# EAGLE design bbb-unibus (EAGLE 6.6.0)
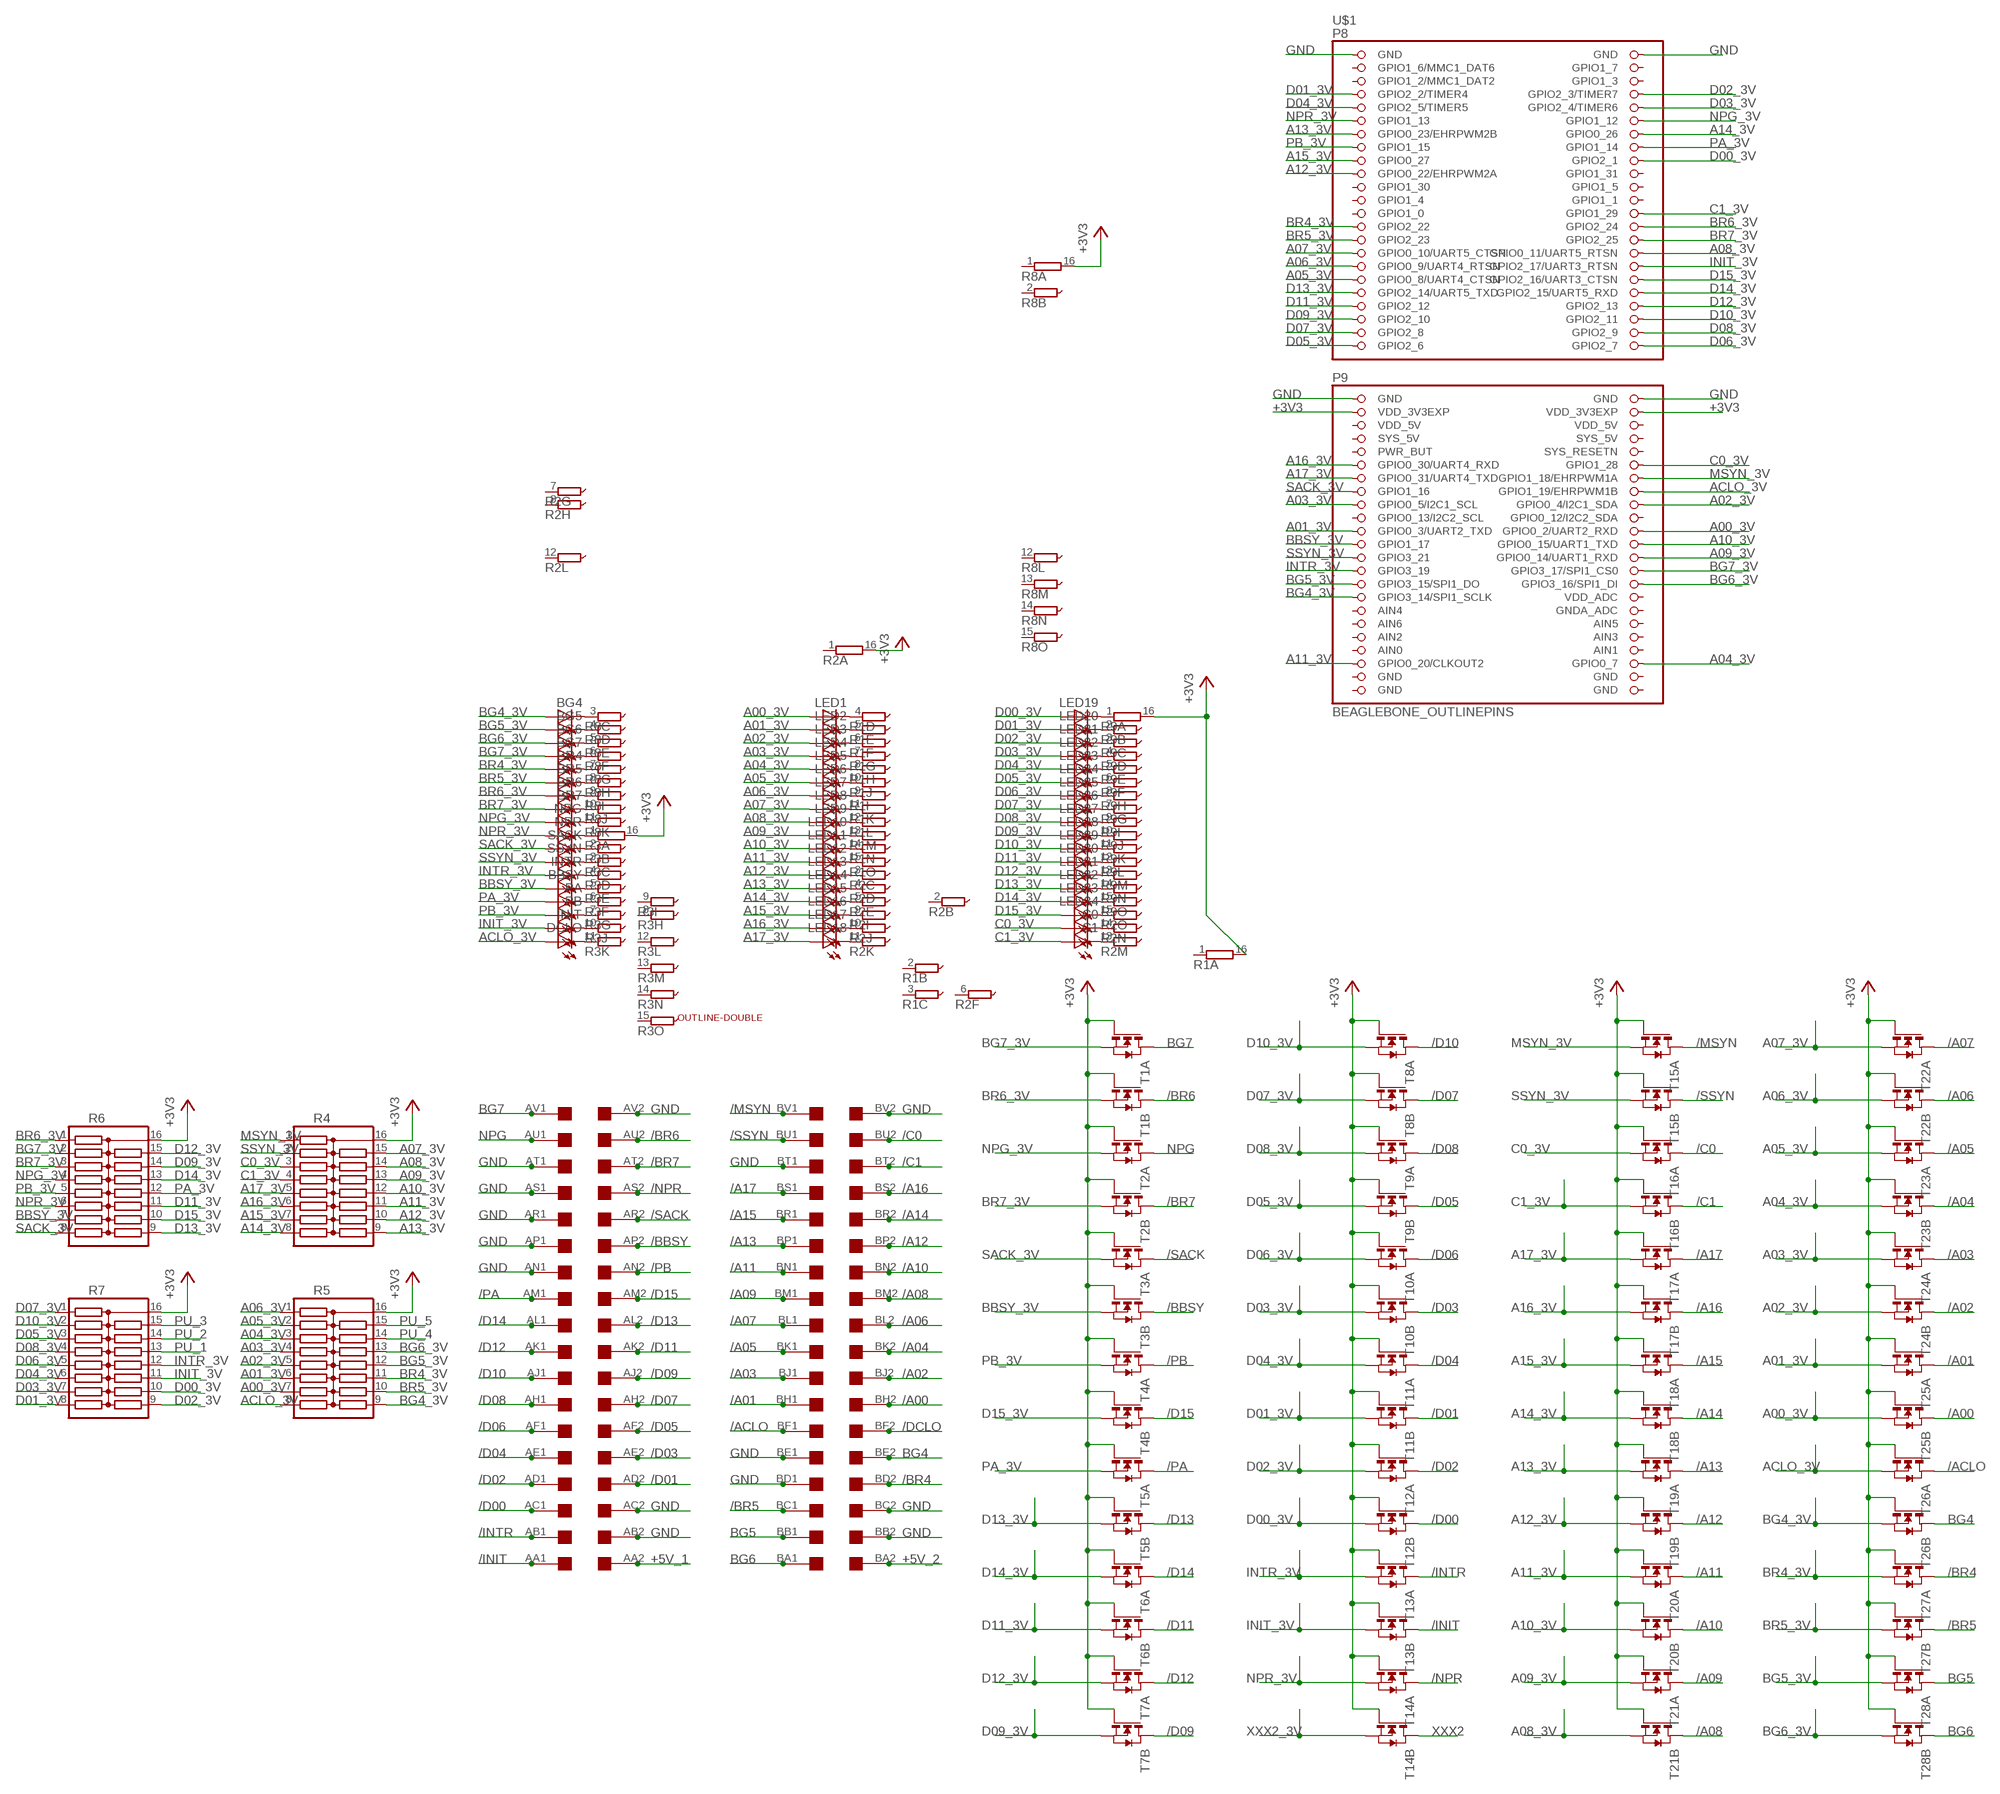
[diagram p0: schematic, sheet 1]

## Parts
BBSY  LEDSML0805  [SML0805]
BG4  LEDSML0805  [SML0805]
BG5  LEDSML0805  [SML0805]
BG6  LEDSML0805  [SML0805]
BG7  LEDSML0805  [SML0805]
BR4  LEDSML0805  [SML0805]
BR5  LEDSML0805  [SML0805]
BR6  LEDSML0805  [SML0805]
BR7  LEDSML0805  [SML0805]
C0  LEDSML0805  [SML0805]
C1  LEDSML0805  [SML0805]
DCLO  LEDSML0805  [SML0805]
INIT  LEDSML0805  [SML0805]
INTR  LEDSML0805  [SML0805]
LED1  LEDSML0805  [SML0805]
LED2  LEDSML0805  [SML0805]
LED3  LEDSML0805  [SML0805]
LED4  LEDSML0805  [SML0805]
LED5  LEDSML0805  [SML0805]
LED6  LEDSML0805  [SML0805]
LED7  LEDSML0805  [SML0805]
LED8  LEDSML0805  [SML0805]
LED9  LEDSML0805  [SML0805]
LED10  LEDSML0805  [SML0805]
LED11  LEDSML0805  [SML0805]
LED12  LEDSML0805  [SML0805]
LED13  LEDSML0805  [SML0805]
LED14  LEDSML0805  [SML0805]
LED15  LEDSML0805  [SML0805]
LED16  LEDSML0805  [SML0805]
LED17  LEDSML0805  [SML0805]
LED18  LEDSML0805  [SML0805]
LED19  LEDSML0805  [SML0805]
LED20  LEDSML0805  [SML0805]
LED21  LEDSML0805  [SML0805]
LED22  LEDSML0805  [SML0805]
LED23  LEDSML0805  [SML0805]
LED24  LEDSML0805  [SML0805]
LED25  LEDSML0805  [SML0805]
LED26  LEDSML0805  [SML0805]
LED27  LEDSML0805  [SML0805]
LED28  LEDSML0805  [SML0805]
LED29  LEDSML0805  [SML0805]
LED30  LEDSML0805  [SML0805]
LED31  LEDSML0805  [SML0805]
LED32  LEDSML0805  [SML0805]
LED33  LEDSML0805  [SML0805]
LED34  LEDSML0805  [SML0805]
NPG  LEDSML0805  [SML0805]
NPR  LEDSML0805  [SML0805]
PA  LEDSML0805  [SML0805]
PB  LEDSML0805  [SML0805]
R1  2QSP16-15E  [2QSP16]
R2  2QSP16-15E  [2QSP16]
R3  2QSP16-15E  [2QSP16]
R4  2QSP16-15  [2QSP16]
R5  2QSP16-15  [2QSP16]
R6  2QSP16-15  [2QSP16]
R7  2QSP16-15  [2QSP16]
R8  2QSP16-15E  [2QSP16]
R9  2QSP16-15E  [2QSP16]
SACK  LEDSML0805  [SML0805]
SSYN  LEDSML0805  [SML0805]
T1  NMOS2-BSS138DW  [SOT363]
T2  NMOS2-BSS138DW  [SOT363]
T3  NMOS2-BSS138DW  [SOT363]
T4  NMOS2-BSS138DW  [SOT363]
T5  NMOS2-BSS138DW  [SOT363]
T6  NMOS2-BSS138DW  [SOT363]
T7  NMOS2-BSS138DW  [SOT363]
T8  NMOS2-BSS138DW  [SOT363]
T9  NMOS2-BSS138DW  [SOT363]
T10  NMOS2-BSS138DW  [SOT363]
T11  NMOS2-BSS138DW  [SOT363]
T12  NMOS2-BSS138DW  [SOT363]
T13  NMOS2-BSS138DW  [SOT363]
T14  NMOS2-BSS138DW  [SOT363]
T15  NMOS2-BSS138DW  [SOT363]
T16  NMOS2-BSS138DW  [SOT363]
T17  NMOS2-BSS138DW  [SOT363]
T18  NMOS2-BSS138DW  [SOT363]
T19  NMOS2-BSS138DW  [SOT363]
T20  NMOS2-BSS138DW  [SOT363]
T21  NMOS2-BSS138DW  [SOT363]
T22  NMOS2-BSS138DW  [SOT363]
T23  NMOS2-BSS138DW  [SOT363]
T24  NMOS2-BSS138DW  [SOT363]
T25  NMOS2-BSS138DW  [SOT363]
T26  NMOS2-BSS138DW  [SOT363]
T27  NMOS2-BSS138DW  [SOT363]
T28  NMOS2-BSS138DW  [SOT363]
U$1  BEAGLEBONE_OUTLINEPINS  [BEAGLEBONE_PINS]
U$2  OUTLINE-DOUBLE  [DOUBLE]
U$3  DOUBLE  [EDGE-CON4]

## Nets
+3V3 [power]: R1.16 R2.16 R3.16 R4.16 R5.16 R6.16 R7.16 R8.16 R9.16 T1.2(A:G) T1.5(B:G) T2.2(A:G) T2.5(B:G) T3.2(A:G) T3.5(B:G) T4.2(A:G) T4.5(B:G) T5.2(A:G) T5.5(B:G) T6.2(A:G) T6.5(B:G) T7.2(A:G) T7.5(B:G) T8.2(A:G) T8.5(B:G) T9.2(A:G) T9.5(B:G) T10.2(A:G) T10.5(B:G) T11.2(A:G) T11.5(B:G) T12.2(A:G) T12.5(B:G) T13.2(A:G) T13.5(B:G) T14.2(A:G) T14.5(B:G) T15.2(A:G) T15.5(B:G) T16.2(A:G) T16.5(B:G) T17.2(A:G) T17.5(B:G) T18.2(A:G) T18.5(B:G) T19.2(A:G) T19.5(B:G) T20.2(A:G) T20.5(B:G) T21.2(A:G) T21.5(B:G) T22.2(A:G) T22.5(B:G) T23.2(A:G) T23.5(B:G) T24.2(A:G) T24.5(B:G) T25.2(A:G) T25.5(B:G) T26.2(A:G) T26.5(B:G) T27.2(A:G) T27.5(B:G) T28.2(A:G) T28.5(B:G) U$1.49(VDD_3V3EXP) U$1.50(VDD_3V3EXP)
+5V_1 [power]: U$3.AA2
+5V_2 [power]: U$3.BA2
/A00 [unibus signal]: T25.6(B:D) U$3.BH2
/A01 [unibus signal]: T25.3(A:D) U$3.BH1
/A02 [unibus signal]: T24.6(B:D) U$3.BJ2
/A03 [unibus signal]: T24.3(A:D) U$3.BJ1
/A04: T23.6(B:D) U$3.BK2
/A05 [unibus signal]: T23.3(A:D) U$3.BK1
/A06 [unibus signal]: T22.6(B:D) U$3.BL2
/A07 [unibus signal]: T22.3(A:D) U$3.BL1
/A08 [unibus signal]: T21.6(B:D) U$3.BM2
/A09 [unibus signal]: T21.3(A:D) U$3.BM1
/A10 [unibus signal]: T20.6(B:D) U$3.BN2
/A11 [unibus signal]: T20.3(A:D) U$3.BN1
/A12 [unibus signal]: T19.6(B:D) U$3.BP2
/A13 [unibus signal]: T19.3(A:D) U$3.BP1
/A14 [unibus signal]: T18.6(B:D) U$3.BR2
/A15 [unibus signal]: T18.3(A:D) U$3.BR1
/A16 [unibus signal]: T17.6(B:D) U$3.BS2
/A17 [unibus signal]: T17.3(A:D) U$3.BS1
/ACLO [unibus signal]: T26.3(A:D) U$3.BF1
/BBSY [unibus signal]: T3.6(B:D) U$3.AP2
/BR4 [unibus signal]: T27.3(A:D) U$3.BD2
/BR5 [unibus signal]: T27.6(B:D) U$3.BC1
/BR6 [unibus signal]: T1.6(B:D) U$3.AU2
/BR7 [unibus signal]: T2.6(B:D) U$3.AT2
/C0 [unibus signal]: T16.3(A:D) U$3.BU2
/C1 [unibus signal]: T16.6(B:D) U$3.BT2
/D00 [unibus signal]: T12.6(B:D) U$3.AC1
/D01 [unibus signal]: T11.6(B:D) U$3.AD2
/D02 [unibus signal]: T12.3(A:D) U$3.AD1
/D03 [unibus signal]: T10.6(B:D) U$3.AE2
/D04 [unibus signal]: T11.3(A:D) U$3.AE1
/D05 [unibus signal]: T9.6(B:D) U$3.AF2
/D06 [unibus signal]: T10.3(A:D) U$3.AF1
/D07 [unibus signal]: T8.6(B:D) U$3.AH2
/D08 [unibus signal]: T9.3(A:D) U$3.AH1
/D09 [unibus signal]: T7.6(B:D) U$3.AJ2
/D10 [unibus signal]: T8.3(A:D) U$3.AJ1
/D11 [unibus signal]: T6.6(B:D) U$3.AK2
/D12 [unibus signal]: T7.3(A:D) U$3.AK1
/D13 [unibus signal]: T5.6(B:D) U$3.AL2
/D14 [unibus signal]: T6.3(A:D) U$3.AL1
/D15 [unibus signal]: T4.6(B:D) U$3.AM2
/DCLO [unibus signal]: U$3.BF2
/INIT [unibus signal]: T13.6(B:D) U$3.AA1
/INTR [unibus signal]: T13.3(A:D) U$3.AB1
/MSYN [power]: T15.3(A:D) U$3.BV1
/NPR [unibus signal]: T14.3(A:D) U$3.AS2
/PA [unibus signal]: T5.3(A:D) U$3.AM1
/PB [unibus signal]: T4.3(A:D) U$3.AN2
/SACK [unibus signal]: T3.3(A:D) U$3.AR2
/SSYN [unibus signal]: T15.6(B:D) U$3.BU1
A00_3V: LED1.A R5.7 T25.4(B:S) U$1.68(GPIO0_2/UART2_RXD)
A01_3V: LED2.A R5.6 T25.1(A:S) U$1.67(GPIO0_3/UART2_TXD)
A02_3V: LED3.A R5.5 T24.4(B:S) U$1.64(GPIO0_4/I2C1_SDA)
A03_3V: LED4.A R5.4 T24.1(A:S) U$1.63(GPIO0_5/I2C1_SCL)
A04_3V: LED5.A R5.3 T23.4(B:S) U$1.88(GPIO0_7)
A05_3V: LED6.A R5.2 T23.1(A:S) U$1.35(GPIO0_8/UART4_CTSN)
A06_3V: LED7.A R5.1 T22.4(B:S) U$1.33(GPIO0_9/UART4_RTSN)
A07_3V: LED8.A R4.15 T22.1(A:S) U$1.31(GPIO0_10/UART5_CTSN)
A08_3V: LED9.A R4.14 T21.4(B:S) U$1.32(GPIO0_11/UART5_RTSN)
A09_3V: LED10.A R4.13 T21.1(A:S) U$1.72(GPIO0_14/UART1_RXD)
A10_3V: LED11.A R4.12 T20.4(B:S) U$1.70(GPIO0_15/UART1_TXD)
A11_3V: LED12.A R4.11 T20.1(A:S) U$1.87(GPIO0_20/CLKOUT2)
A12_3V: LED13.A R4.10 T19.4(B:S) U$1.19(GPIO0_22/EHRPWM2A)
A13_3V: LED14.A R4.9 T19.1(A:S) U$1.13(GPIO0_23/EHRPWM2B)
A14_3V: LED15.A R4.8 T18.4(B:S) U$1.14(GPIO0_26)
A15_3V: LED16.A R4.7 T18.1(A:S) U$1.17(GPIO0_27)
A16_3V: LED17.A R4.6 T17.4(B:S) U$1.57(GPIO0_30/UART4_RXD)
A17_3V: LED18.A R4.5 T17.1(A:S) U$1.59(GPIO0_31/UART4_TXD)
ACLO_3V: DCLO.A R5.8 T26.1(A:S) U$1.62(GPIO1_19/EHRPWM1B)
BBSY_3V: BBSY.A R6.7 T3.4(B:S) U$1.69(GPIO1_17)
BG4 [unibus signal]: T26.6(B:D) U$3.BE2
BG4_3V: BG4.A R5.9 T26.4(B:S) U$1.77(GPIO3_14/SPI1_SCLK)
BG5 [unibus signal]: T28.3(A:D) U$3.BB1
BG5_3V: BG5.A R5.12 T28.1(A:S) U$1.75(GPIO3_15/SPI1_DO)
BG6 [unibus signal]: T28.6(B:D) U$3.BA1
BG6_3V: BG6.A R5.13 T28.4(B:S) U$1.76(GPIO3_16/SPI1_DI)
BG7 [unibus signal]: T1.3(A:D) U$3.AV1
BG7_3V: BG7.A R6.2 T1.1(A:S) U$1.74(GPIO3_17/SPI1_CS0)
BR4_3V: BR4.A R5.11 T27.1(A:S) U$1.27(GPIO2_22)
BR5_3V: BR5.A R5.10 T27.4(B:S) U$1.29(GPIO2_23)
BR6_3V: BR6.A R6.1 T1.4(B:S) U$1.28(GPIO2_24)
BR7_3V: BR7.A R6.3 T2.4(B:S) U$1.30(GPIO2_25)
C0_3V: C0.A R4.3 T16.1(A:S) U$1.58(GPIO1_28)
C1_3V: C1.A R4.4 T16.4(B:S) U$1.26(GPIO1_29)
D00_3V: LED19.A R7.10 T12.4(B:S) U$1.18(GPIO2_1)
D01_3V: LED20.A R7.8 T11.4(B:S) U$1.7(GPIO2_2/TIMER4)
D02_3V: LED21.A R7.9 T12.1(A:S) U$1.8(GPIO2_3/TIMER7)
D03_3V: LED22.A R7.7 T10.4(B:S) U$1.10(GPIO2_4/TIMER6)
D04_3V: LED23.A R7.6 T11.1(A:S) U$1.9(GPIO2_5/TIMER5)
D05_3V: LED24.A R7.3 T9.4(B:S) U$1.45(GPIO2_6)
D06_3V: LED25.A R7.5 T10.1(A:S) U$1.46(GPIO2_7)
D07_3V: LED26.A R7.1 T8.4(B:S) U$1.43(GPIO2_8)
D08_3V: LED27.A R7.4 T9.1(A:S) U$1.44(GPIO2_9)
D09_3V: LED28.A R6.14 T7.4(B:S) U$1.41(GPIO2_10)
D10_3V: LED29.A R7.2 T8.1(A:S) U$1.42(GPIO2_11)
D11_3V: LED30.A R6.11 T6.4(B:S) U$1.39(GPIO2_12)
D12_3V: LED31.A R6.15 T7.1(A:S) U$1.40(GPIO2_13)
D13_3V: LED32.A R6.9 T5.4(B:S) U$1.37(GPIO2_14/UART5_TXD)
D14_3V: LED33.A R6.13 T6.1(A:S) U$1.38(GPIO2_15/UART5_RXD)
D15_3V: LED34.A R6.10 T4.4(B:S) U$1.36(GPIO2_16/UART3_CTSN)
GND [power]: U$1.1(GND) U$1.2(GND) U$1.47(GND) U$1.48(GND) U$3.AB2 U$3.AC2 U$3.AN1 U$3.AP1 U$3.AR1 U$3.AS1 U$3.AT1 U$3.AV2 U$3.BB2 U$3.BC2 U$3.BD1 U$3.BE1 U$3.BT1 U$3.BV2
INIT_3V: INIT.A R7.11 T13.4(B:S) U$1.34(GPIO2_17/UART3_RTSN)
INTR_3V: INTR.A R7.12 T13.1(A:S) U$1.73(GPIO3_19)
MSYN_3V: R4.1 T15.1(A:S) U$1.60(GPIO1_18/EHRPWM1A)
N$1: LED34.C R2.15
N$2: C0.C R2.14
N$3: C1.C R2.13
N$4: LED16.C R2.9
N$5 [power]: LED1.C R1.4
N$6 [power]: LED2.C R1.5
N$7 [power]: LED3.C R1.6
N$8 [power]: LED4.C R1.7
N$9 [power]: LED5.C R1.8
N$10: LED6.C R1.10
N$11: LED7.C R1.9
N$12 [power]: LED8.C R1.11
N$13 [power]: LED9.C R1.12
N$14 [power]: LED10.C R1.13
N$15 [power]: LED11.C R1.14
N$16 [power]: LED12.C R1.15
N$17: LED13.C R2.3
N$18: LED17.C R2.10
N$19: LED18.C R2.11
N$20: LED14.C R2.4
N$21: LED15.C R2.5
N$22: BR5.C R8.8
N$23: BR4.C R8.7
N$24: BG7.C R8.6
N$25: BG6.C R8.5
N$26: BG5.C R8.4
N$27: BG4.C R8.3
N$28: BR6.C R8.9
N$29: BR7.C R8.10
N$30: NPG.C R8.11
N$31: LED26.C R9.7
N$32 [power]: NPR.C R3.1
N$33: LED25.C R9.8
N$34 [power]: R3.2 SACK.C
N$35 [power]: R3.3 SSYN.C
N$36 [power]: INTR.C R3.4
N$37 [power]: LED19.C R9.1
N$38 [power]: LED20.C R9.2
N$39 [power]: LED21.C R9.3
N$40 [power]: LED22.C R9.4
N$41 [power]: LED23.C R9.5
N$42 [power]: LED24.C R9.6
N$45 [power]: LED27.C R9.9
N$46 [power]: LED28.C R9.10
N$47 [power]: LED29.C R9.11
N$48 [power]: LED30.C R9.12
N$49 [power]: LED31.C R9.13
N$50 [power]: LED32.C R9.14
N$51 [power]: LED33.C R9.15
N$52 [power]: BBSY.C R3.5
N$53 [power]: PA.C R3.6
N$54 [power]: PB.C R3.7
N$55 [power]: INIT.C R3.10
N$56 [power]: DCLO.C R3.11
NPG [unibus signal]: T2.3(A:D) U$3.AU1
NPG_3V: NPG.A R6.4 T2.1(A:S) U$1.12(GPIO1_12)
NPR_3V: NPR.A R6.6 T14.1(A:S) U$1.11(GPIO1_13)
PA_3V: PA.A R6.12 T5.1(A:S) U$1.16(GPIO1_14)
PB_3V: PB.A R6.5 T4.1(A:S) U$1.15(GPIO1_15)
PU_1: R7.13
PU_2: R7.14
PU_3: R7.15
PU_4: R5.14
PU_5: R5.15
SACK_3V: R6.8 SACK.A T3.1(A:S) U$1.61(GPIO1_16)
SSYN_3V: R4.2 SSYN.A T15.4(B:S) U$1.71(GPIO3_21)
XXX2 [unibus signal]: T14.6(B:D)
XXX2_3V: T14.4(B:S)
Unconnected: R1.1 R1.2 R1.3 R2.1 R2.2 R2.6 R2.7 R2.8 R2.12 R3.8 R3.9 R3.12 R3.13 R3.14 R3.15 R8.1 R8.2 R8.12 R8.13 R8.14 R8.15 U$1.3(GPIO1_6/MMC1_DAT6) U$1.4(GPIO1_7) U$1.5(GPIO1_2/MMC1_DAT2) U$1.6(GPIO1_3) U$1.20(GPIO1_31) U$1.21(GPIO1_30) U$1.22(GPIO1_5) U$1.23(GPIO1_4) U$1.24(GPIO1_1) U$1.25(GPIO1_0) U$1.54(SYS_5V) U$1.55(PWR_BUT) U$1.56(SYS_RESETN) U$1.65(GPIO0_13/I2C2_SCL) U$1.66(GPIO0_12/I2C2_SDA) U$1.78(VDD_ADC) U$1.79(AIN4) U$1.80(GNDA_ADC) U$1.81(AIN6) U$1.82(AIN5) U$1.83(AIN2) U$1.84(AIN3) U$1.86(AIN1)

## Power pins joined to a net without a drawn wire
AIN0: U$1.85(AIN0)
SYS_5V: U$1.53(SYS_5V)
UNUSED_GND0: U$1.89(GND)
UNUSED_GND1: U$1.91(GND)
UNUSED_GND2: U$1.90(GND)
UNUSED_GND3: U$1.92(GND)
VDD_5V: U$1.51(VDD_5V) U$1.52(VDD_5V)

## Library data of the parts
BBSY BG4-BG7 BR4-BR7 C0 C1 DCLO INIT INTR LED1-LED34 NPG NPR PA PB SACK SSYN = led:LED: LED OSRAM: - CHIPLED LG R971, LG N971, LY N971, LG Q971, LY Q971, LO R971, LY R971 LH N974, LH R974 LS Q976, LO Q976, LY Q976 LO Q996 - Hyper CHIPLED LW Q18S LB Q993, LB Q99A, LB R99A - SideLED LS A670, LO A670, LY A670, LG A670, LP A670 LB A673, LV A673, LT A673, LW A673 LH A674 LY A675 LS A676, LA A676, LO A676, LY A676, LW A676 LS A679, LY A679, LG A679 - Hyper Micro SIDELED® LS Y876, LA Y876, LO Y876, LY Y876 LT Y87S - SmartLED LW L88C, LW L88S LB L89C, LB L89S, LG L890 LS L89K, LO L89K, LY L89K LS L896, LA L896, LO L896, LY L896 - TOPLED LS T670, LO T670, LY T670, LG T670, LP T670 LSG T670, LSP T670, LSY T670, LOP T670, LYG T670 LG T671, LOG T671, LSG T671 LB T673, LV T673, LT T673, LW T673 LH T674 LS T676, LA T676, LO T676, LY T676, LB T676, LH T676, LSB T676, LW T676 LB T67C, LV T67C, LT T67C, LS T67K, LO T67K, LY T67K, LW E67C LS E67B, LA E67B, LO E67B, LY E67B, LB E67C, LV E67C, LT E67C LW T67C LS T679, LY T679, LG T679 LS T770, LO T770, LY T770, LG T770, LP T770 LB T773, LV T773, LT T773, LW T773 LH T774 LS E675, LA E675, LY E675, LS T675 LS T776, LA T776, LO T776, LY T776, LB T776 LHGB T686 LT T68C, LB T68C - Hyper Mini TOPLED® LB M676 - Mini TOPLED Santana® LG M470 LS M47K, LO M47K, LY M47K Source: http://www.osram.convergy.de LUXEON: - LUMILED® LXK2-PW12-R00, LXK2-PW12-S00, LXK2-PW14-U00, LXK2-PW14-V00 LXK2-PM12-R00, LXK2-PM12-S00, LXK2-PM14-U00 LXK2-PE12-Q00, LXK2-PE12-R00, LXK2-PE12-S00, LXK2-PE14-T00, LXK2-PE14-U00 LXK2-PB12-K00, LXK2-PB12-L00, LXK2-PB12-M00, LXK2-PB14-N00, LXK2-PB14-P00, LXK2-PB14-Q00 LXK2-PR12-L00, LXK2-PR12-M00, LXK2-PR14-Q00, LXK2-PR14-R00 LXK2-PD12-Q00, LXK2-PD12-R00, LXK2-PD12-S00 LXK2-PH12-R00, LXK2-PH12-S00 LXK2-PL12-P00, LXK2-PL12-Q00, LXK2-PL12-R00 Source: www.luxeon.com KINGBRIGHT: KA-3528ASYC Source: www.kingbright.com
R1-R3 R8 R9 = resistor-bourns:2QSP16-15E: BOURNS RESISTOR NETWORK; OC_FARNELL: unknown; OC_NEWARK: unknown
R4-R7 = resistor-bourns:2QSP16-15: BOURNS RESISTOR NETWORK; OC_FARNELL: unknown; OC_NEWARK: unknown
T1-T28 = kblom:NMOS2: Dual MOS FET nmos; FARNELL: 1713832
U$1 = adafruit:BEAGLEBONE_OUTLINE: Should match A3 pinout - but not completely tested
U$2 = dec-con:OUTLINE-*: Board outlines for DEC boards.
U$3 = dec-con:DOUBLE: Double-Height DEC board

## Net classes
0 default: width 0.254 mm
1 unibus signal: width 0.457 mm
2 power: width 0.457 mm

## Board
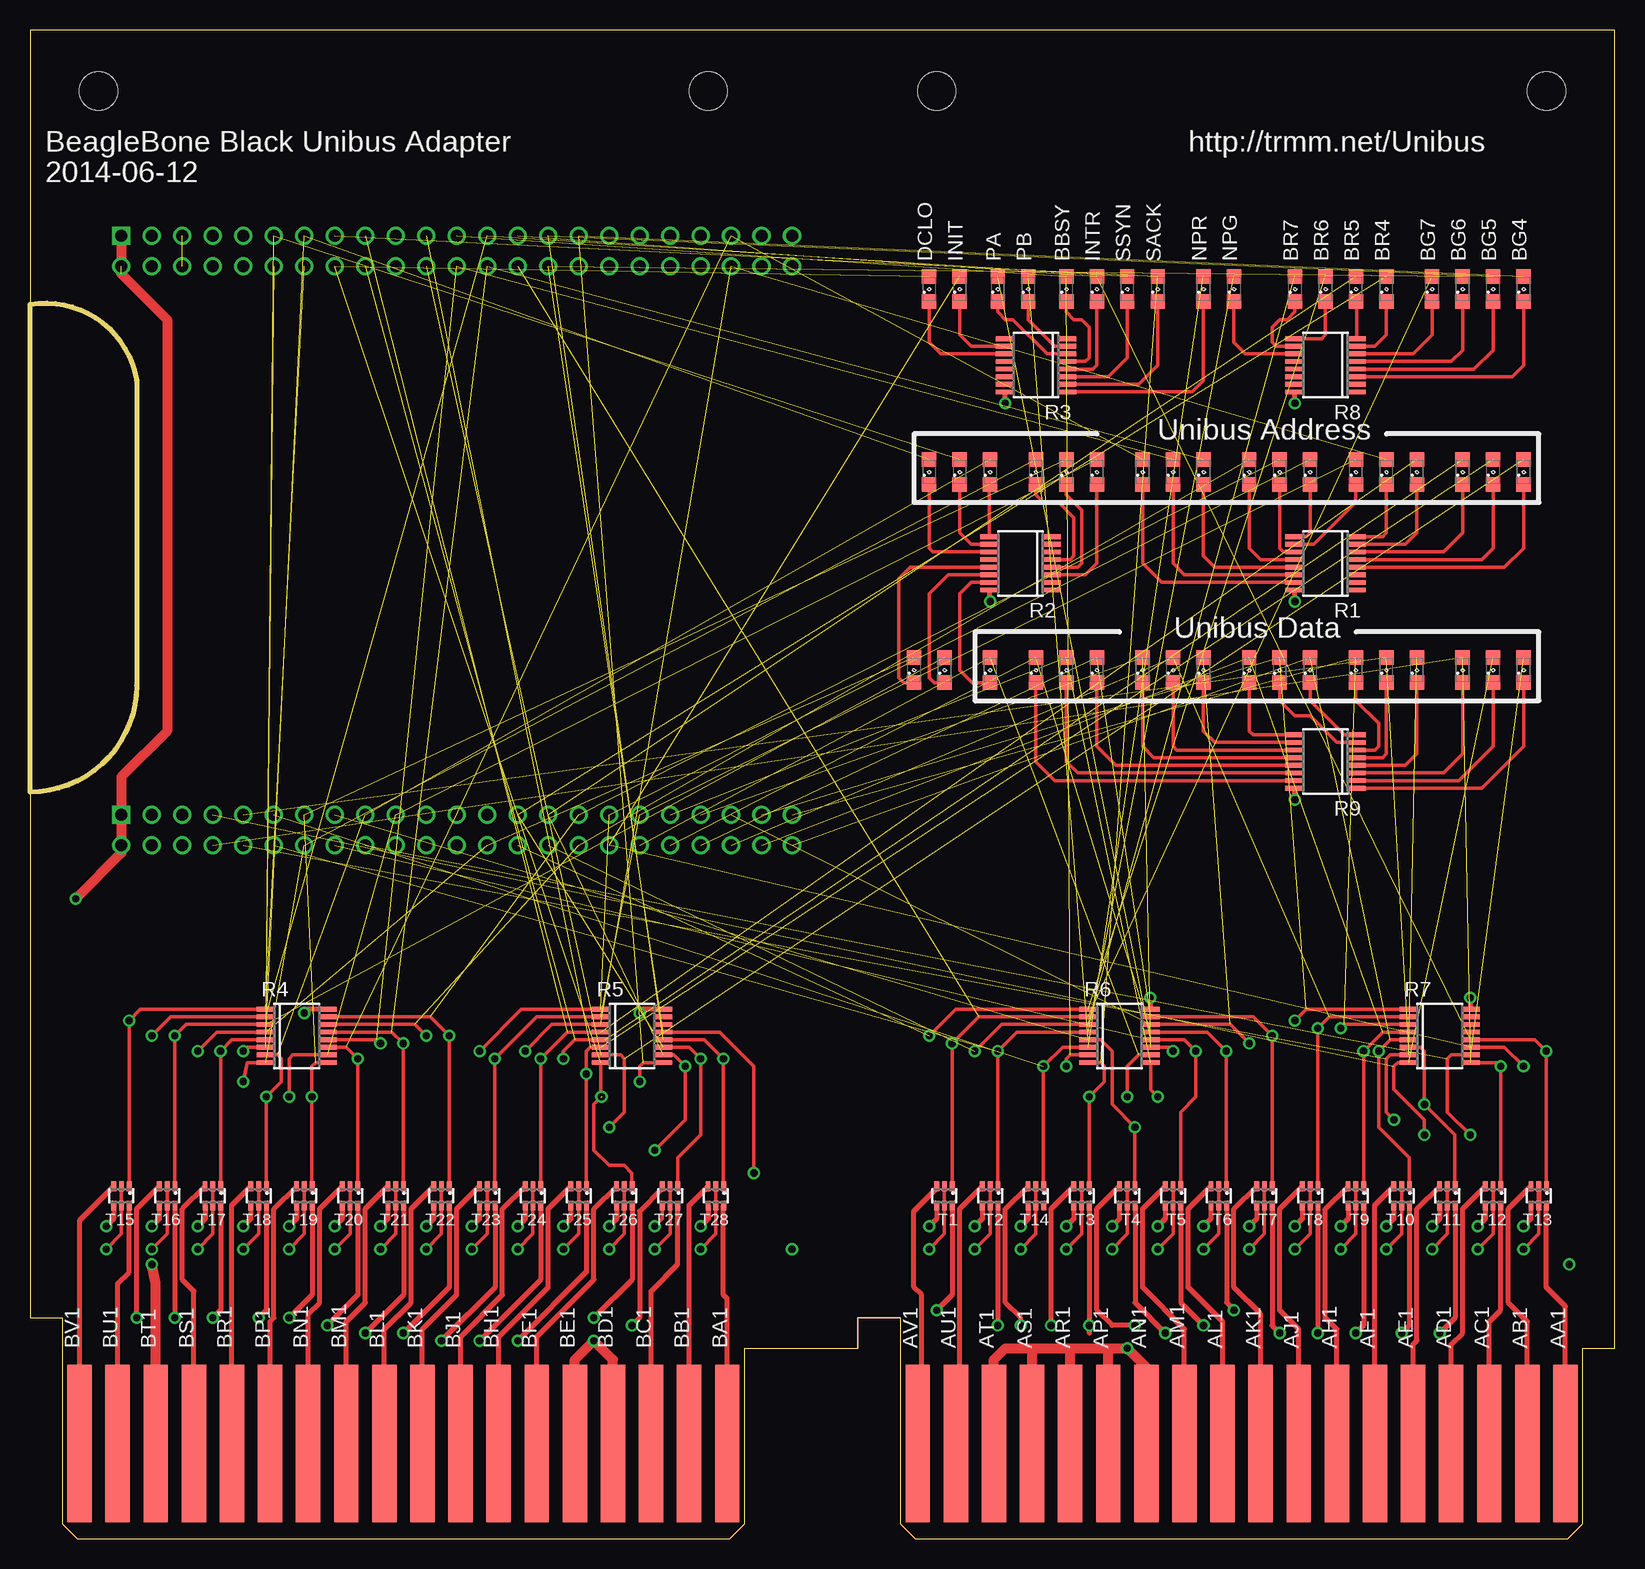
[diagram p1: board, top side]
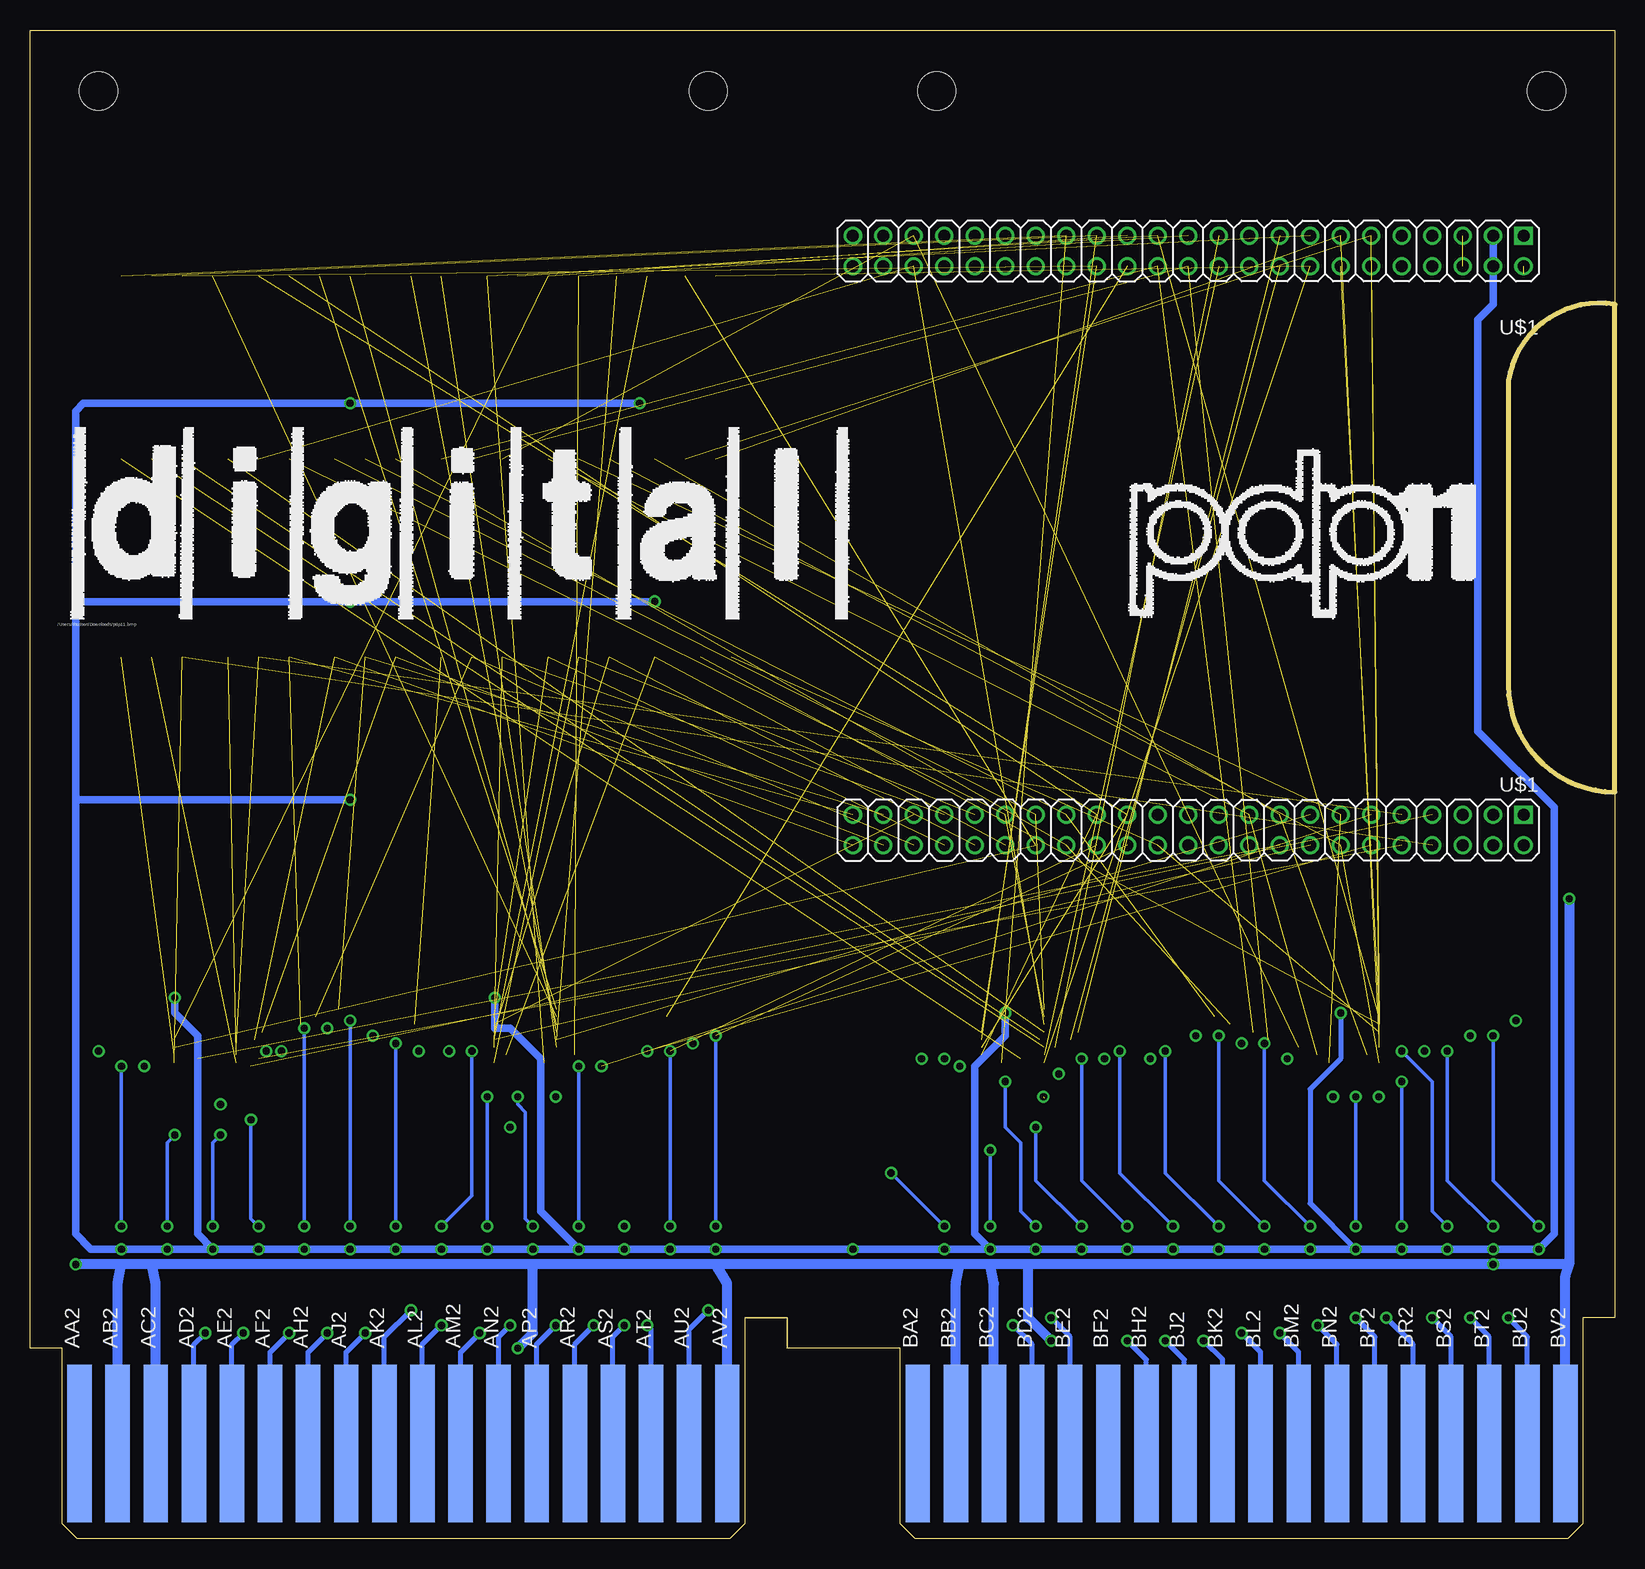
[diagram p2: board, bottom side, seen from below]

Size 132.08 x 125.73 mm. Coordinates in mm from the lower left corner, seen from the top.
Copper layers (1*16): Top 0.035mm / dielectric 1.5mm / Bottom 0.035mm
Design rules "default": minimum track width 10mil, minimum drill 24mil, track to track 8mil, track to pad 8mil, pad to pad 8mil, via to via 8mil, smd to smd 8mil, copper to edge 40mil, drill to drill 8mil, minimum pad ring 10mil, minimum via ring 8mil, stop-mask expansion 4mil, vias tented up to drill 0mil, thermal gap 10mil

### Footprints (pad centres in the part's own frame; a part is rotated, then mirrored left to right if it is on the bottom)
SML0805 = smd 1.2 x 1.2: A 1.05,0; C -1.05,0
2QSP16 = smd 0.4 x 1.5: 1 -2.223,-2.6; 2 -1.588,-2.6; 3 -0.953,-2.6; 4 -0.318,-2.6; 5 0.318,-2.6; 6 0.953,-2.6; 7 1.588,-2.6; 8 2.223,-2.6; 9 2.223,2.6; 10 1.588,2.6; 11 0.953,2.6; 12 0.318,2.6; 13 -0.318,2.6; 14 -0.953,2.6; 15 -1.588,2.6; 16 -2.223,2.6
SOT363 = smd 0.4 x 0.8: 1 -0.65,-0.8; 2 0,-0.8; 3 0.65,-0.8; 4 0.65,0.8; 5 0,0.8; 6 -0.65,0.8
BEAGLEBONE_PINS = drill 1 square: 1 4.445,5.08; 47 52.705,5.08 | drill 1: 2 1.905,5.08; 3 4.445,7.62; 4 1.905,7.62; 5 4.445,10.16; 6 1.905,10.16; 7 4.445,12.7; 8 1.905,12.7; 9 4.445,15.24; 10 1.905,15.24; 11 4.445,17.78; 12 1.905,17.78; 13 4.445,20.32; 14 1.905,20.32; 15 4.445,22.86; 16 1.905,22.86; 17 4.445,25.4; 18 1.905,25.4; 19 4.445,27.94; 20 1.905,27.94; 21 4.445,30.48; 22 1.905,30.48; 23 4.445,33.02; 24 1.905,33.02; 25 4.445,35.56; 26 1.905,35.56; 27 4.445,38.1; 28 1.905,38.1; 29 4.445,40.64; 30 1.905,40.64; 31 4.445,43.18; 32 1.905,43.18; 33 4.445,45.72; 34 1.905,45.72; 35 4.445,48.26; 36 1.905,48.26; 37 4.445,50.8; 38 1.905,50.8; 39 4.445,53.34; 40 1.905,53.34; 41 4.445,55.88; 42 1.905,55.88; 43 4.445,58.42; 44 1.905,58.42; 45 4.445,60.96; 46 1.905,60.96; 48 50.165,5.08; 49 52.705,7.62; 50 50.165,7.62; 51 52.705,10.16; 52 50.165,10.16; 53 52.705,12.7; 54 50.165,12.7; 55 52.705,15.24; 56 50.165,15.24; 57 52.705,17.78; 58 50.165,17.78; 59 52.705,20.32; 60 50.165,20.32; 61 52.705,22.86; 62 50.165,22.86; 63 52.705,25.4; 64 50.165,25.4; 65 52.705,27.94; 66 50.165,27.94; 67 52.705,30.48; 68 50.165,30.48; 69 52.705,33.02; 70 50.165,33.02; 71 52.705,35.56; 72 50.165,35.56; 73 52.705,38.1; 74 50.165,38.1; 75 52.705,40.64; 76 50.165,40.64; 77 52.705,43.18; 78 50.165,43.18; 79 52.705,45.72; 80 50.165,45.72; 81 52.705,48.26; 82 50.165,48.26; 83 52.705,50.8; 84 50.165,50.8; 85 52.705,53.34; 86 50.165,53.34; 87 52.705,55.88; 88 50.165,55.88; 89 52.705,58.42; 90 50.165,58.42; 91 52.705,60.96; 92 50.165,60.96
DOUBLE = hole 3.175: 120.65,56.515; 120.65,5.715; 120.65,75.565; 120.65,126.365
EDGE-CON4 = smd 13.106 x 2.032: AA1 7.938,4.128; AB1 7.938,7.303; AC1 7.938,10.477; AD1 7.938,13.652; AE1 7.938,16.828; AF1 7.938,20.003; AH1 7.938,23.177; AJ1 7.938,26.352; AK1 7.938,29.527; AL1 7.938,32.703; AM1 7.938,35.877; AN1 7.938,39.053; AP1 7.938,42.227; AR1 7.938,45.403; AS1 7.938,48.578; AT1 7.938,51.752; AU1 7.938,54.928; AV1 7.938,58.102; BA1 7.938,73.978; BB1 7.938,77.153; BC1 7.938,80.328; BD1 7.938,83.502; BE1 7.938,86.677; BF1 7.938,89.853; BH1 7.938,93.028; BJ1 7.938,96.203; BK1 7.938,99.377; BL1 7.938,102.552; BM1 7.938,105.728; BN1 7.938,108.903; BP1 7.938,112.078; BR1 7.938,115.252; BS1 7.938,118.427; BT1 7.938,121.603; BU1 7.938,124.778; BV1 7.938,127.953 | smd 13.106 x 2.032 bottom: AA2 7.938,4.128; AB2 7.938,7.303; AC2 7.938,10.477; AD2 7.938,13.652; AE2 7.938,16.828; AF2 7.938,20.003; AH2 7.938,23.177; AJ2 7.938,26.352; AK2 7.938,29.527; AL2 7.938,32.703; AM2 7.938,35.877; AN2 7.938,39.053; AP2 7.938,42.227; AR2 7.938,45.403; AS2 7.938,48.578; AT2 7.938,51.752; AU2 7.938,54.928; AV2 7.938,58.102; BA2 7.938,73.978; BB2 7.938,77.153; BC2 7.938,80.328; BD2 7.938,83.502; BE2 7.938,86.677; BF2 7.938,89.853; BH2 7.938,93.028; BJ2 7.938,96.203; BK2 7.938,99.377; BL2 7.938,102.552; BM2 7.938,105.728; BN2 7.938,108.903; BP2 7.938,112.078; BR2 7.938,115.252; BS2 7.938,118.427; BT2 7.938,121.603; BU2 7.938,124.778; BV2 7.938,127.953

### Placement (x,y rotation side)
BBSY  86.36,104.14 90 top
BG4  124.46,104.14 90 top
BG5  121.92,104.14 90 top
BG6  119.38,104.14 90 top
BG7  116.84,104.14 90 top
BR4  113.03,104.14 90 top
BR5  110.49,104.14 90 top
BR6  107.95,104.14 90 top
BR7  105.41,104.14 90 top
C0  76.2,72.39 90 top
C1  73.66,72.39 90 top
DCLO  74.93,104.14 90 top
INIT  77.47,104.14 90 top
INTR  88.9,104.14 90 top
LED1  124.46,88.9 90 top
LED2  121.92,88.9 90 top
LED3  119.38,88.9 90 top
LED4  115.57,88.9 90 top
LED5  113.03,88.9 90 top
LED6  110.49,88.9 90 top
LED7  106.68,88.9 90 top
LED8  104.14,88.9 90 top
LED9  101.6,88.9 90 top
LED10  97.79,88.9 90 top
LED11  95.25,88.9 90 top
LED12  92.71,88.9 90 top
LED13  88.9,88.9 90 top
LED14  86.36,88.9 90 top
LED15  83.82,88.9 90 top
LED16  80.01,88.9 90 top
LED17  77.47,88.9 90 top
LED18  74.93,88.9 90 top
LED19  124.46,72.39 90 top
LED20  121.92,72.39 90 top
LED21  119.38,72.39 90 top
LED22  115.57,72.39 90 top
LED23  113.03,72.39 90 top
LED24  110.49,72.39 90 top
LED25  106.68,72.39 90 top
LED26  104.14,72.39 90 top
LED27  101.6,72.39 90 top
LED28  97.79,72.39 90 top
LED29  95.25,72.39 90 top
LED30  92.71,72.39 90 top
LED31  88.9,72.39 90 top
LED32  86.36,72.39 90 top
LED33  83.82,72.39 90 top
LED34  80.01,72.39 90 top
NPG  100.33,104.14 90 top
NPR  97.79,104.14 90 top
PA  80.65,104.14 90 top
PB  83.19,104.14 90 top
R1  107.95,81.28 90 top
R2  82.55,81.28 90 top
R3  83.82,97.79 90 top
R4  22.23,41.91 270 top
R5  50.17,41.91 270 top
R6  90.81,41.91 270 top
R7  117.48,41.91 270 top
R8  107.95,97.79 90 top
R9  107.95,64.77 90 top
SACK  93.98,104.14 90 top
SSYN  91.44,104.14 90 top
T1  76.2,28.58 180 top
T2  80.01,28.58 180 top
T3  87.63,28.58 180 top
T4  91.44,28.58 180 top
T5  95.25,28.58 180 top
T6  99.06,28.58 180 top
T7  102.87,28.58 180 top
T8  106.68,28.58 180 top
T9  110.49,28.58 180 top
T10  114.3,28.58 180 top
T11  118.11,28.58 180 top
T12  121.92,28.58 180 top
T13  125.73,28.58 180 top
T14  83.82,28.58 180 top
T15  7.62,28.58 180 top
T16  11.43,28.58 180 top
T17  15.24,28.58 180 top
T18  19.05,28.58 180 top
T19  22.86,28.58 180 top
T20  26.67,28.58 180 top
T21  30.48,28.58 180 top
T22  34.29,28.58 180 top
T23  38.1,28.58 180 top
T24  41.91,28.58 180 top
T25  45.72,28.58 180 top
T26  49.53,28.58 180 top
T27  53.34,28.58 180 top
T28  57.15,28.58 180 top
U$1  2.54,55.88 90 bottom
U$2  132.08,0 90 top
U$3  132.08,0 90 top

### Tracks (layer width: path | path; a pad name or v marks a point on that pad's centre or on a via)
+3V3  (via drill 0.6)
  Top 0.305: v124.46,24.13 125.73,25.4 T13.5 | v120.65,24.13 121.92,25.4 T12.5 T12.2 | v116.84,24.13 118.11,25.4 T11.5 T11.2 | v113.03,24.13 114.3,25.4 T10.5 T10.2 | v109.22,24.13 110.49,25.4 T9.5 T9.2 | v105.41,24.13 106.68,25.4 T8.5 T8.2 | v101.6,24.13 102.87,25.4 T7.5 T7.2 | v97.79,24.13 99.06,25.4 T6.5 T6.2 | v93.98,24.13 95.25,25.4 T5.5 T5.2 | v90.17,24.13 91.44,25.4 T4.5 T4.2 | v86.36,24.13 87.63,25.4 T3.5 T3.2 | T14.5 83.82,27.94 | T14.5 83.82,25.4 v82.55,24.13 | v78.74,24.13 80.01,25.4 T2.5 T2.2 | v74.93,24.13 76.2,25.4 T1.5 T1.2 | T14.2 T14.5 | v55.88,24.13 57.15,25.4 T28.5 T28.2 | v52.07,24.13 53.34,25.4 T27.5 T27.2 | v48.26,24.13 49.53,25.4 T26.5 T26.2 | v44.45,24.13 45.72,25.4 T25.5 T25.2 | v40.64,24.13 41.91,25.4 T24.5 T24.2 | v36.83,24.13 38.1,25.4 T23.5 T23.2 | v33.02,24.13 34.29,25.4 T22.5 T22.2 | v29.21,24.13 30.48,25.4 T21.5 T21.2 | v25.4,24.13 26.67,25.4 T20.5 T20.2 | v21.59,24.13 22.86,25.4 T19.5 T19.2 | v17.78,24.13 19.05,25.4 T18.5 T18.2 | v13.97,24.13 15.24,25.4 T17.5 T17.2 | v10.16,24.13 11.43,25.4 T16.5 T16.2 | v6.35,24.13 7.62,25.4 T15.5 T15.2
  Top 0.406: T13.2 T13.5 | R4.16 23.18,44.13 v22.86,43.82 | R5.16 51.12,44.13 v50.8,43.82 | R2.16 79.95,78.17 v80.01,78.11 | R1.16 105.35,78.17 v105.41,78.11 | R9.16 105.35,61.66 v105.41,61.6 | R3.16 81.22,94.68 v81.28,94.62 | R8.16 105.35,94.68 v105.41,94.62 | R7.16 120.08,45.03 v120.02,45.09 | R6.16 93.41,45.03 v93.35,45.09
  Bottom 0.406: v22.86,43.82 22.86,40.01 25.4,37.47 25.4,27.94 v21.59,24.13
  Bottom 0.61: v52.07,24.13 v48.26,24.13 v44.45,24.13 v40.64,24.13 v36.83,24.13 v33.02,24.13 v29.21,24.13 v25.4,24.13 v21.59,24.13 v17.78,24.13 v13.97,24.13 v10.16,24.13 v6.35,24.13 5.08,25.4 5.08,60.96 11.43,67.31 11.43,101.6 10.16,102.87 U$1.50 U$1.49 | v52.07,24.13 v55.88,24.13 v63.5,24.13 v74.93,24.13 v78.74,24.13 v82.55,24.13 v86.36,24.13 | v86.36,24.13 v90.17,24.13 v93.98,24.13 v97.79,24.13 v101.6,24.13 v105.41,24.13 v109.22,24.13 v113.03,24.13 v116.84,24.13 | v116.84,24.13 v120.65,24.13 v124.46,24.13 127,24.13 128.27,25.4 128.27,61.6 | v81.28,94.62 v105.41,94.62 127.64,94.62 128.27,93.98 128.27,78.11 | v80.01,78.11 v105.41,78.11 128.27,78.11 | 128.27,61.6 v105.41,61.6 111.76,61.6 | 128.27,61.6 128.27,78.11 | v50.8,43.82 50.8,41.91 53.34,39.37 53.34,25.4 v52.07,24.13 | v93.35,45.09 93.35,42.55 92.08,42.55 89.54,40.01 89.54,27.31 v86.36,24.13 | v120.02,45.09 120.02,43.82 118.11,41.91 118.11,25.4 v116.84,24.13
/A00  (via drill 0.6)
  Top 0.406: T25.6 46.37,22.24 v40.64,16.51
  Bottom 0.406: U$3.BH2 39.05,14.92 v40.64,16.51
/A01
  Top 0.406: U$3.BH1 39.05,16.83 43.18,20.96 43.18,27.49 T25.3
/A02  (via drill 0.6)
  Top 0.406: T24.6 42.56,21.61 v37.47,16.51
  Bottom 0.406: U$3.BJ2 35.88,14.92 v37.47,16.51
/A03
  Top 0.406: U$3.BJ1 35.88,16.83 39.37,20.32 39.37,27.49 T24.3
/A04  (via drill 0.6)
  Top 0.406: T23.6 38.75,20.97 v34.29,16.51
  Bottom 0.406: U$3.BK2 32.7,14.92 v34.29,16.51
/A05
  Top 0.406: U$3.BK1 32.7,17.46 35.56,20.32 35.56,27.49 T23.3
/A06  (via drill 0.6)
  Top 0.406: T22.6 34.94,20.97 v31.12,17.15
  Bottom 0.406: U$3.BL2 29.53,15.56 v31.12,17.15
/A07
  Top 0.406: U$3.BL1 29.53,17.46 31.75,19.69 31.75,27.49 T22.3
/A08  (via drill 0.6)
  Top 0.406: T21.6 31.13,20.34 v27.94,17.15
  Bottom 0.406: U$3.BM2 26.35,15.56 v27.94,17.15
/A09
  Top 0.406: U$3.BM1 26.35,18.1 27.94,19.69 27.94,27.49 T21.3
/A10  (via drill 0.6)
  Top 0.406: T20.6 27.32,20.34 v24.77,17.78
  Bottom 0.406: U$3.BN2 23.18,16.19 v24.77,17.78
/A11
  Top 0.406: U$3.BN1 23.18,18.73 24.13,19.69 24.13,27.49 T20.3
/A12  (via drill 0.6)
  Top 0.406: T19.6 23.51,20.34 v21.59,18.42
  Bottom 0.406: U$3.BP2 20,16.83 v21.59,18.42
/A13
  Top 0.406: U$3.BP1 20,18.1 20.32,18.42 20.32,27.49 T19.3
/A14  (via drill 0.6)
  Top 0.406: T18.6 19.7,19.07 v19.05,18.42
  Bottom 0.406: U$3.BR2 16.83,16.19 v19.05,18.42
/A15
  Top 0.406: U$3.BR1 16.83,27.8 T18.3
/A16  (via drill 0.6)
  Top 0.406: T17.6 15.89,19.07 v15.24,18.42
  Bottom 0.406: U$3.BS2 13.65,16.83 v15.24,18.42
/A17
  Top 0.406: U$3.BS1 13.65,20.64 12.7,21.59 12.7,27.49 T17.3
/ACLO
  Top 0.406: U$3.BF1 42.23,16.83 46.99,21.59 46.99,27.49 T26.3
/BBSY  (via drill 0.6)
  Top 0.406: T3.6 88.28,17.13 v88.27,17.78
  Bottom 0.406: U$3.AP2 89.85,16.19 v88.27,17.78
/BR4  (via drill 0.6)
  Top 0.406: T27.3 52.69,29.2 50.8,27.31 50.8,18.42 v50.17,17.78
  Bottom 0.406: U$3.BD2 48.58,16.19 v50.17,17.78
/BR5
  Top 0.406: U$3.BC1 51.75,20.64 53.98,22.86 53.98,27.76 T27.6
/BR6  (via drill 0.6)
  Top 0.406: T1.6 76.85,20.34 v75.57,19.05
  Bottom 0.406: U$3.AU2 77.15,17.46 v75.57,19.05
/BR7  (via drill 0.6)
  Top 0.406: T2.6 80.66,17.8 v80.65,17.78
  Bottom 0.406: U$3.AT2 80.33,17.46 v80.65,17.78
/C0  (via drill 0.6)
  Top 0.406: v8.89,18.42 8.89,27.49 T16.3
  Bottom 0.406: U$3.BU2 7.3,16.83 v8.89,18.42
/C1  (via drill 0.6)
  Top 0.406: T16.6 12.08,18.43 v12.07,18.42
  Bottom 0.406: U$3.BT2 10.48,16.83 v12.07,18.42
/D00
  Top 0.406: U$3.AC1 121.6,18.1 122.56,19.05 122.56,27.76 T12.6
/D01  (via drill 0.6)
  Top 0.406: T11.6 118.76,18.43 v117.48,17.15
  Bottom 0.406: U$3.AD2 118.43,16.19 v117.48,17.15
/D02
  Top 0.406: U$3.AD1 118.43,16.19 119.38,17.15 119.38,27.49 T12.3
/D03  (via drill 0.6)
  Top 0.406: T10.6 114.95,17.8 v114.3,17.15
  Bottom 0.406: U$3.AE2 115.25,16.19 v114.3,17.15
/D04
  Top 0.406: U$3.AE1 115.25,16.19 115.57,16.51 115.57,27.49 T11.3
/D05  (via drill 0.6)
  Top 0.406: T9.6 111.14,17.8 v110.49,17.15
  Bottom 0.406: U$3.AF2 112.08,15.56 v110.49,17.15
/D06
  Top 0.406: U$3.AF1 112.08,27.8 T10.3
/D07  (via drill 0.6)
  Top 0.406: T8.6 107.33,17.8 v107.32,17.15
  Bottom 0.406: U$3.AH2 108.9,15.56 v107.32,17.15
/D08
  Top 0.406: U$3.AH1 108.9,17.46 107.95,18.42 107.95,27.49 T9.3
/D09  (via drill 0.6)
  Top 0.406: T7.6 103.52,17.77 v104.14,17.15
  Bottom 0.406: U$3.AJ2 105.73,15.56 v104.14,17.15
/D10
  Top 0.406: U$3.AJ1 105.73,17.46 104.14,19.05 104.14,27.49 T8.3
/D11  (via drill 0.6)
  Top 0.406: T6.6 99.71,19.67 v100.33,19.05
  Bottom 0.406: U$3.AK2 102.55,16.83 v100.33,19.05
/D12
  Top 0.406: U$3.AK1 102.55,18.73 100.33,20.96 100.33,27.49 T7.3
/D13  (via drill 0.6)
  Top 0.406: T5.6 95.9,19.67 v97.79,17.78
  Bottom 0.406: U$3.AL2 99.38,16.19 v97.79,17.78
/D14
  Top 0.406: U$3.AL1 99.38,18.1 96.52,20.96 96.52,27.49 T6.3
/D15  (via drill 0.6)
  Top 0.406: T4.6 92.09,19.67 v94.62,17.15
  Bottom 0.406: U$3.AM2 96.2,15.56 v94.62,17.15
/INIT
  Top 0.406: U$3.AA1 127.95,19.37 126.37,20.96 126.37,27.76 T13.6
/INTR
  Top 0.406: U$3.AB1 124.78,18.1 123.19,19.69 123.19,27.49 T13.3
/MSYN
  Top 0.406: U$3.BV1 4.13,26.53 T15.3
/NPR  (via drill 0.6)
  Top 0.406: v82.55,17.78 82.55,18.42 81.28,19.69 81.28,27.49 T14.3
  Bottom 0.406: U$3.AS2 83.5,16.83 v82.55,17.78
/PA
  Top 0.406: U$3.AM1 96.2,17.46 92.71,20.96 92.71,27.49 T5.3
/PB  (via drill 0.6)
  Top 0.406: v92.08,17.78 90.17,17.78 88.9,19.05 88.9,27.49 T4.3
  Bottom 0.406: U$3.AN2 93.03,16.83 v92.08,17.78
/SACK  (via drill 0.6)
  Top 0.406: v85.09,17.78 85.09,27.49 T3.3
  Bottom 0.406: U$3.AR2 86.68,16.19 v85.09,17.78
/SSYN
  Top 0.406: U$3.BU1 7.3,21.27 8.26,22.23 8.26,27.76 T15.6
A00_3V  (via drill 0.6)  (2 unrouted)
  Top 0.305: R5.7 49.21,40.32 49.53,40.01 49.53,35.56 v48.26,34.29
  Top 0.406: T25.4 45.07,26.66 v44.45,26.04
  Bottom 0.305: v48.26,34.29 48.26,29.85 v44.45,26.04
A01_3V  (via drill 0.6)  (2 unrouted)
  Top 0.305: R5.6 46.67,40.96 46.36,40.64 v46.36,38.74 46.36,29.39 T25.1
A02_3V  (via drill 0.6)  (2 unrouted)
  Top 0.305: 47.94,41.59 R5.5 45.4,41.59 44.45,40.64 v44.45,40.01
  Top 0.406: T24.4 41.26,26.66 v40.64,26.04
  Bottom 0.305: v44.45,40.01 44.45,29.85 v40.64,26.04
A03_3V  (via drill 0.6)  (2 unrouted)
  Top 0.305: R5.4 44.77,42.23 v42.55,40.01 42.55,29.39 T24.1
A04_3V  (via drill 0.6)  (2 unrouted)
  Top 0.305: R5.3 43.5,42.86 v41.28,40.64
  Top 0.406: T23.4 37.45,26.66 v36.83,26.04
  Bottom 0.305: v41.28,40.64 41.28,30.48 v36.83,26.04
A05_3V  (via drill 0.6)  (2 unrouted)
  Top 0.305: R5.2 42.23,43.5 v38.74,40.01 38.74,29.39 T23.1
A06_3V  (via drill 0.6)  (2 unrouted)
  Top 0.305: R5.1 40.96,44.13 v37.47,40.64
  Top 0.406: T22.4 33.64,26.66 v33.02,26.04
  Bottom 0.305: v37.47,40.64 37.47,30.48 v33.02,26.04
A07_3V  (via drill 0.6)  (2 unrouted)
  Top 0.305: R4.15 33.34,43.5 v34.93,41.91 34.93,29.39 T22.1
A08_3V  (via drill 0.6)  (2 unrouted)
  Top 0.305: R4.14 32.07,42.86 v33.02,41.91
  Top 0.406: T21.4 29.83,26.66 v29.21,26.04
  Bottom 0.305: v33.02,41.91 33.02,29.85 v29.21,26.04
A09_3V  (via drill 0.6)  (2 unrouted)
  Top 0.305: R4.13 30.16,42.23 v31.12,41.28 31.12,29.39 T21.1
A10_3V  (via drill 0.6)  (2 unrouted)
  Top 0.305: R4.12 28.89,41.59 v29.21,41.28
  Top 0.406: T20.4 26.02,26.66 v25.4,26.04
  Bottom 0.305: v29.21,41.28 29.21,29.85 v25.4,26.04
A11_3V  (via drill 0.6)  (2 unrouted)
  Top 0.305: R4.11 26.35,40.96 v27.31,40.01 27.31,29.39 T20.1
A12_3V  (via drill 0.6)  (2 unrouted)
  Top 0.305: R4.10 21.91,40.32 21.59,40.01 v21.59,36.83
  Top 0.406: T19.4 22.21,26.66 v21.59,26.04
  Bottom 0.305: v21.59,36.83 v21.59,26.04
A13_3V  (via drill 0.6)  (2 unrouted)
  Top 0.305: R4.9 23.81,39.69 23.5,39.37 v23.5,36.83 23.5,29.39 T19.1
A14_3V  (via drill 0.6)  (2 unrouted)
  Top 0.305: R4.8 18.1,39.69 v17.78,38.1
  Top 0.406: T18.4 18.4,26.66 v17.78,26.04
  Bottom 0.305: v17.78,38.1 v17.78,26.04
A15_3V  (via drill 0.6)  (2 unrouted)
  Top 0.305: R4.7 20.64,40.32 20.96,40.01 20.96,38.1 v19.69,36.83 19.69,29.39 T18.1
A16_3V  (via drill 0.6)  (2 unrouted)
  Top 0.305: R4.6 18.1,40.96 v17.78,40.64
  Top 0.406: T17.4 14.59,26.66 v13.97,26.04
  Bottom 0.305: v17.78,40.64 15.24,38.1 15.24,27.31 v13.97,26.04
A17_3V  (via drill 0.6)  (2 unrouted)
  Top 0.305: R4.5 16.83,41.59 v15.88,40.64 15.88,29.39 T17.1
ACLO_3V  (via drill 0.6)  (3 unrouted)
  Top 0.305: R5.8 47.57,36.77 46.99,36.2 46.99,32.39 48.26,31.12 49.53,31.12 50.17,30.48 50.17,29.39 T26.1
  other vias: 47.63,36.83
BBSY_3V  (via drill 0.6)  (2 unrouted)
  Top 0.305: R6.7 86.68,40.32 86.36,40.01 v86.36,39.37
  Top 0.406: T3.4 86.98,26.66 v86.36,26.04
  Bottom 0.305: v86.36,39.37 v86.36,26.04
BG4  (via drill 0.6)
  Top 0.406: T26.6 50.18,21.61 v46.99,18.42
  Bottom 0.406: U$3.BE2 45.4,16.83 v46.99,18.42
BG4_3V  (via drill 0.6)  (2 unrouted)
  Top 0.305: R5.9 51.12,39.69 50.8,39.37 v50.8,38.1
  Top 0.406: T26.4 48.88,26.66 v48.26,26.04
  Bottom 0.305: v50.8,38.1 50.8,34.29 49.53,33.02 49.53,27.31 v48.26,26.04
BG5
  Top 0.406: U$3.BB1 54.93,27.8 T28.3
BG5_3V  (via drill 0.6)  (2 unrouted)
  Top 0.305: R5.12 56.2,41.59 v57.79,40.01 57.79,29.39 T28.1
BG6
  Top 0.406: U$3.BA1 58.1,20 57.79,20.32 57.79,27.76 T28.6
BG6_3V  (via drill 0.6)  (2 unrouted)
  Top 0.305: R5.13 57.47,42.23 60.33,39.37 v60.33,30.48
  Top 0.406: T28.4 56.5,26.66 v55.88,26.04
  Bottom 0.305: v60.33,30.48 v55.88,26.04
BG7
  Top 0.406: U$3.AV1 74.3,8.26 74.3,20.32 73.66,20.96 73.66,27.31 75.55,29.2 T1.3
BG7_3V  (via drill 0.6)  (2 unrouted)
  Top 0.305: R6.2 79.06,43.5 v76.84,41.28 76.84,29.39 T1.1
BR4_3V  (via drill 0.6)  (2 unrouted)
  Top 0.305: R5.11 54.93,40.96 v55.88,40.01 55.88,33.66 53.98,31.75 53.98,29.39 T27.1
BR5_3V  (via drill 0.6)  (2 unrouted)
  Top 0.305: R5.10 53.66,40.32 v54.61,39.37 54.61,34.93 v52.07,32.39 | T27.4 52.69,26.66 v52.07,26.04
  Bottom 0.305: v52.07,32.39 v52.07,26.04
BR6_3V  (via drill 0.6)  (2 unrouted)
  Top 0.305: R6.1 77.15,44.13 v74.93,41.91
  Top 0.406: T1.4 75.55,26.66 v74.93,26.04
  Bottom 0.305: v74.93,41.91 v74.93,26.04
BR7_3V  (via drill 0.6)  (2 unrouted)
  Top 0.305: R6.3 80.96,42.86 v78.74,40.64
  Top 0.406: T2.4 79.36,26.66 v78.74,26.04
  Bottom 0.305: v78.74,40.64 v78.74,26.04
C0_3V  (via drill 0.6)  (2 unrouted)
  Top 0.305: R4.3 13.02,42.86 v12.07,41.91 12.07,29.39 T16.1
C1_3V  (via drill 0.6)  (2 unrouted)
  Top 0.305: R4.4 15.56,42.23 v13.97,40.64
  Top 0.406: T16.4 10.78,26.66 v10.16,26.04
  Bottom 0.305: v13.97,40.64 13.97,29.85 v10.16,26.04
D00_3V  (via drill 0.6)  (2 unrouted)
  Top 0.305: R7.10 118.43,40.32 118.11,40.01 118.11,35.56 v120.02,33.66
  Top 0.406: T12.4 121.27,26.66 v120.65,26.04
  Bottom 0.305: v120.02,33.66 120.65,33.02 v120.65,26.04
D01_3V  (via drill 0.6)  (2 unrouted)
  Top 0.305: R7.8 113.98,39.69 113.67,39.37 113.67,37.47 116.21,34.93 v116.21,33.66
  Top 0.406: T11.4 117.46,26.66 v116.84,26.04
  Bottom 0.305: v116.21,33.66 116.84,33.02 v116.84,26.04
D02_3V  (via drill 0.6)  (2 unrouted)
  Top 0.305: R7.9 122.24,39.69 v122.56,39.37 122.56,29.39 T12.1
D03_3V  (via drill 0.6)  (2 unrouted)
  Top 0.305: R7.7 113.35,40.32 113.03,40.01 113.03,35.56 v113.67,34.93
  Top 0.406: T10.4 113.65,26.66 v113.03,26.04
  Bottom 0.305: v113.67,34.93 113.67,26.67 v113.03,26.04
D04_3V  (via drill 0.6)  (2 unrouted)
  Top 0.305: R7.6 115.89,40.96 116.21,40.64 v116.21,36.2 118.75,33.66 118.75,29.39 T11.1
D05_3V  (via drill 0.6)  (2 unrouted)
  Top 0.305: R7.3 109.54,42.86 v109.22,42.55
  Top 0.406: T9.4 109.84,26.66 v109.22,26.04
  Bottom 0.305: v109.22,42.55 v109.22,26.04
D06_3V  (via drill 0.6)  (2 unrouted)
  Top 0.305: R7.5 113.35,41.59 v112.4,40.64 112.4,34.29 114.94,31.75 114.94,29.39 T10.1
D07_3V  (via drill 0.6)  (2 unrouted)
  Top 0.305: R7.1 106.36,44.13 v105.41,43.18
  Top 0.406: T8.4 106.03,26.66 v105.41,26.04
  Bottom 0.305: v105.41,43.18 v105.41,26.04
D08_3V  (via drill 0.6)  (2 unrouted)
  Top 0.305: R7.4 112.71,42.23 v111.13,40.64 111.13,29.39 T9.1
D09_3V  (via drill 0.6)  (2 unrouted)
  Top 0.305: R6.14 100.01,42.86 v101.6,41.28
  Top 0.406: T7.4 102.22,26.66 v101.6,26.04
  Bottom 0.305: v101.6,41.28 v101.6,26.04
D10_3V  (via drill 0.6)  (2 unrouted)
  Top 0.305: R7.2 108.27,43.5 v107.32,42.55 107.32,29.39 T8.1
D11_3V  (via drill 0.6)  (2 unrouted)
  Top 0.305: R6.11 94.93,40.96 v95.25,40.64
  Top 0.406: T6.4 98.41,26.66 v97.79,26.04
  Bottom 0.305: v95.25,40.64 95.25,28.58 v97.79,26.04
D12_3V  (via drill 0.6)  (2 unrouted)
  Top 0.305: R6.15 101.92,43.5 v103.51,41.91 103.51,29.39 T7.1
D13_3V  (via drill 0.6)  (2 unrouted)
  Top 0.305: R6.9 93.41,37.41 v93.98,36.83
  Top 0.406: T5.4 94.6,26.66 v93.98,26.04
  Bottom 0.305: v93.98,36.83 v93.98,26.04
D14_3V  (via drill 0.6)  (2 unrouted)
  Top 0.305: R6.13 98.11,42.23 v99.7,40.64 99.7,29.39 T6.1
D15_3V  (via drill 0.6)  (2 unrouted)
  Top 0.305: R6.10 92.39,40.32 91.44,39.37 v91.44,36.83
  Top 0.406: T4.4 90.79,26.66 v90.17,26.04
  Bottom 0.305: v91.44,36.83 91.44,36.2 90.81,35.56 90.81,26.67 v90.17,26.04
GND  (via drill 0.6)  (1 unrouted)
  Top 0.813: U$1.47 7.62,105.41 11.43,101.6 11.43,67.31 7.62,63.5 U$1.1 U$1.2 7.62,57.15 v3.81,53.34 | U$3.BT1 10.48,21.27 v10.16,22.86 | U$3.BE1 45.4,14.92 v46.99,16.51 48.58,14.92 U$3.BD1 | U$3.AN1 93.03,14.29 v91.44,15.88 90.17,15.88 | U$3.AT1 80.33,14.92 81.28,15.88 83.82,15.88 | 83.82,15.88 86.36,15.88 | 86.36,15.88 90.17,15.88 | U$3.AS1 83.5,15.56 83.82,15.88 | U$3.AR1 86.68,15.56 86.36,15.88 | U$3.AP1 89.85,15.56 90.17,15.88
  Bottom 0.813: v3.81,53.34 3.81,22.86 | 3.81,22.86 v10.16,22.86 48.9,22.86 | 48.9,22.86 52.07,22.86 | 52.07,22.86 54.61,22.86 | 54.61,22.86 74.93,22.86 | 74.93,22.86 90.17,22.86 | 90.17,22.86 121.92,22.86 | 121.92,22.86 124.46,22.86 | 124.46,22.86 v128.27,22.86 | U$3.BV2 4.13,21.91 3.81,22.86 | U$3.BC2 51.75,21.27 52.07,22.86 | U$3.BB2 54.93,21.27 54.61,22.86 | U$3.AV2 73.98,21.27 74.93,22.86 | v46.99,16.51 48.9,18.42 48.9,22.86 | v91.44,15.88 90.17,17.15 90.17,22.86 | U$3.AC2 121.6,21.27 121.92,22.86 | U$3.AB2 124.78,21.27 124.46,22.86
INIT_3V  (via drill 0.6)  (2 unrouted)
  Top 0.305: R7.11 122.87,40.96 v124.46,39.37
  Top 0.406: T13.4 125.08,26.66 v124.46,26.04
  Bottom 0.305: v124.46,39.37 v124.46,26.04
INTR_3V  (via drill 0.6)  (2 unrouted)
  Top 0.305: R7.12 125.41,41.59 v126.37,40.64 126.37,29.39 T13.1
MSYN_3V  (via drill 0.6)  (1 unrouted)
  Top 0.305: R4.1 9.21,44.13 v8.26,43.18 8.26,29.39 T15.1
N$1
  Top 0.305: LED34.C 78.52,71.34 77.47,72.39 77.47,78.74 78.42,79.69 R2.15
N$2
  Top 0.305: C0.C 75.35,71.34 74.93,71.76 74.93,78.74 76.52,80.33 R2.14
N$3
  Top 0.305: R2.13 73.34,80.96 72.39,80.01 72.39,71.76 72.81,71.34 C1.C
N$4
  Top 0.305: R2.9 79.95,87.79 LED16.C
N$5
  Top 0.305: R1.4 122.87,80.96 124.46,82.55 LED1.C
N$6
  Top 0.305: R1.5 120.97,81.6 121.92,82.55 LED2.C
N$7
  Top 0.305: R1.6 117.79,82.23 119.38,83.82 LED3.C
N$8
  Top 0.305: R1.7 114.62,82.87 115.57,83.82 LED4.C
N$9
  Top 0.305: R1.8 112.71,83.5 113.03,83.82 LED5.C
N$10
  Top 0.305: R1.10 107,82.87 110.49,86.36 LED6.C
N$11
  Top 0.305: R1.9 106.36,83.5 106.68,83.82 LED7.C
N$12
  Top 0.305: R1.11 104.46,82.23 104.14,82.55 LED8.C
N$13
  Top 0.305: R1.12 102.55,81.6 101.6,82.55 LED9.C
N$14
  Top 0.305: R1.13 98.74,80.96 97.79,81.92 LED10.C
N$15
  Top 0.305: R1.14 96.2,80.33 95.25,81.28 LED11.C
N$16
  Top 0.305: R1.15 94.3,79.69 92.71,81.28 LED12.C
N$17
  Top 0.305: R2.3 87.95,80.33 88.9,81.28 LED13.C
N$18
  Top 0.305: R2.10 78.42,82.87 77.47,83.82 LED17.C
N$19
  Top 0.305: R2.11 75.25,82.23 74.93,82.55 LED18.C
N$20
  Top 0.305: R2.4 87.31,80.96 87.63,81.28 87.63,85.73 86.36,87 LED14.C
N$21
  Top 0.305: R2.5 86.68,81.6 87,81.92 87,85.09 85.73,86.36 84.46,86.36 83.82,87 LED15.C
N$22
  Top 0.305: R8.8 110.55,103.03 BR5.C
N$23
  Top 0.305: R8.7 112.08,99.38 113.03,100.33 BR4.C
N$24
  Top 0.305: R8.6 115.25,98.74 116.84,100.33 BG7.C
N$25
  Top 0.305: R8.5 118.43,98.11 119.38,99.06 BG6.C
N$26
  Top 0.305: R8.4 120.33,97.47 121.92,99.06 BG5.C
N$27
  Top 0.305: R8.3 123.51,96.84 124.46,97.79 BG4.C
N$28
  Top 0.305: R8.9 107.63,100.01 107.95,100.33 BR6.C
N$29
  Top 0.305: R8.10 103.82,99.38 103.51,99.7 103.51,100.97 104.14,101.6 104.78,101.6 105.41,102.24 BR7.C
N$30
  Top 0.305: R8.11 101.28,98.74 100.33,99.7 NPG.C
N$31
  Top 0.305: R9.7 108.9,66.36 106.68,68.58 105.41,68.58 104.14,69.85 LED26.C
N$32
  Top 0.305: R3.1 96.84,95.57 97.79,96.52 NPR.C
N$33
  Top 0.305: R9.8 109.54,66.99 106.68,69.85 LED25.C
N$34
  Top 0.305: R3.2 92.39,96.2 93.98,97.79 SACK.C
N$35
  Top 0.305: R3.3 89.85,96.84 91.44,98.43 SSYN.C
N$36
  Top 0.305: R3.4 88.58,97.47 88.9,97.79 INTR.C
N$37
  Top 0.305: R9.1 120.97,62.55 124.46,66.04 LED19.C
N$38
  Top 0.305: R9.2 119.06,63.18 121.92,66.04 LED20.C
N$39
  Top 0.305: R9.3 117.79,63.82 119.38,65.41 LED21.C
N$40
  Top 0.305: R9.4 114.62,64.45 115.57,65.41 LED22.C
N$41
  Top 0.305: R9.5 112.71,65.09 113.03,65.41 LED23.C
N$42
  Top 0.305: R9.6 112.08,65.72 112.4,66.04 112.4,67.95 110.49,69.85 LED24.C
N$45
  Top 0.305: R9.9 101.92,66.99 101.6,67.31 LED27.C
N$46
  Top 0.305: R9.10 98.74,66.36 97.79,67.31 LED28.C
N$47
  Top 0.305: R9.11 95.57,65.72 95.25,66.04 LED29.C
N$48
  Top 0.305: R9.12 93.66,65.09 92.71,66.04 LED30.C
N$49
  Top 0.305: R9.13 90.49,64.45 88.9,66.04 LED31.C
N$50
  Top 0.305: R9.14 87.31,63.82 86.36,64.77 LED32.C
N$51
  Top 0.305: R9.15 85.41,63.18 83.82,64.77 LED33.C
N$52
  Top 0.305: R3.5 87.95,98.11 88.27,98.43 88.27,100.97 87.63,101.6 87,101.6 86.36,102.24 BBSY.C
N$53
  Top 0.305: R3.6 84.77,98.74 81.92,101.6 81.28,101.6 80.65,102.24 PA.C
N$54
  Top 0.305: R3.7 85.41,99.38 83.19,101.6 PB.C
N$55
  Top 0.305: R3.10 78.42,99.38 77.47,100.33 INIT.C
N$56
  Top 0.305: R3.11 75.88,98.74 74.93,99.7 DCLO.C
NPG
  Top 0.406: U$3.AU1 77.47,8.26 77.47,27.49 T2.3
NPG_3V  (via drill 0.6)  (2 unrouted)
  Top 0.305: R6.4 82.23,42.23 v80.65,40.64 80.65,29.39 T2.1
NPR_3V  (via drill 0.6)  (2 unrouted)
  Top 0.305: R6.6 86.04,40.96 v84.46,39.37 84.46,29.39 T14.1
PA_3V  (via drill 0.6)  (2 unrouted)
  Top 0.305: R6.12 96.2,41.59 v97.16,40.64 97.16,36.83 95.89,35.56 95.89,29.39 T5.1
PB_3V  (via drill 0.6)  (2 unrouted)
  Top 0.305: R6.5 89.22,41.59 90.17,40.64 90.17,36.2 v92.08,34.29 92.08,29.39 T4.1
SACK_3V  (via drill 0.6)  (2 unrouted)
  Top 0.305: R6.8 89.22,39.69 89.54,39.37 89.54,38.1 v88.27,36.83 88.27,29.39 T3.1
SSYN_3V  (via drill 0.6)  (2 unrouted)
  Top 0.305: R4.2 11.75,43.5 v10.16,41.91
  Top 0.406: T15.4 6.97,26.66 v6.35,26.04
  Bottom 0.305: v10.16,41.91 10.16,29.85 v6.35,26.04
VDD_5V  (1 unrouted)
XXX2_3V  (via drill 0.6)
  Top 0.406: T14.4 83.17,26.66 v82.55,26.04

### Text on the board
tNames: BeagleBone Black Unibus Adapter | http://trmm.net/Unibus | 2014-06-12 | Unibus Address | Unibus Data
bNames: /Users/thudson/Downloads/pdp11.bmp